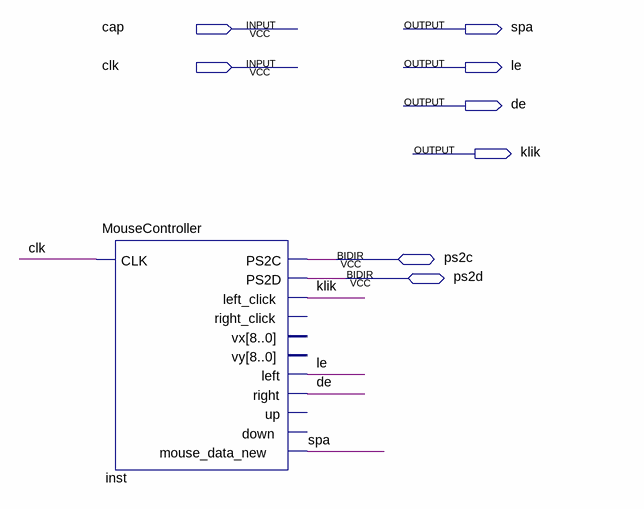
[diagram p0: schematic sheet]
// Quartus schematic slanje.bdf as structural Verilog: 1 symbols, 8 pins
module slanje (
  input  cap,
  input  clk,
  inout  ps2c,
  inout  ps2d,
  output spa,
  output le,
  output de,
  output klik
);

  MouseController inst (
    .CLK(clk), .left_click(klik), .left(le), .right(de), .mouse_data_new(spa), .PS2C(ps2c), .PS2D(ps2d));  // open: right_click, vx, vy, up, down
endmodule
